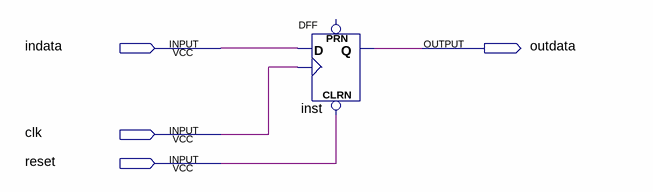
[diagram p0: schematic sheet]
// Quartus schematic dfftest.bdf as structural Verilog: 1 symbols, 4 pins
module dfftest (
  input  indata,
  input  clk,
  input  reset,
  output outdata
);

  DFF inst (.CLRN(reset), .CLK(clk), .D(indata), .Q(outdata));  // open: PRN
endmodule
